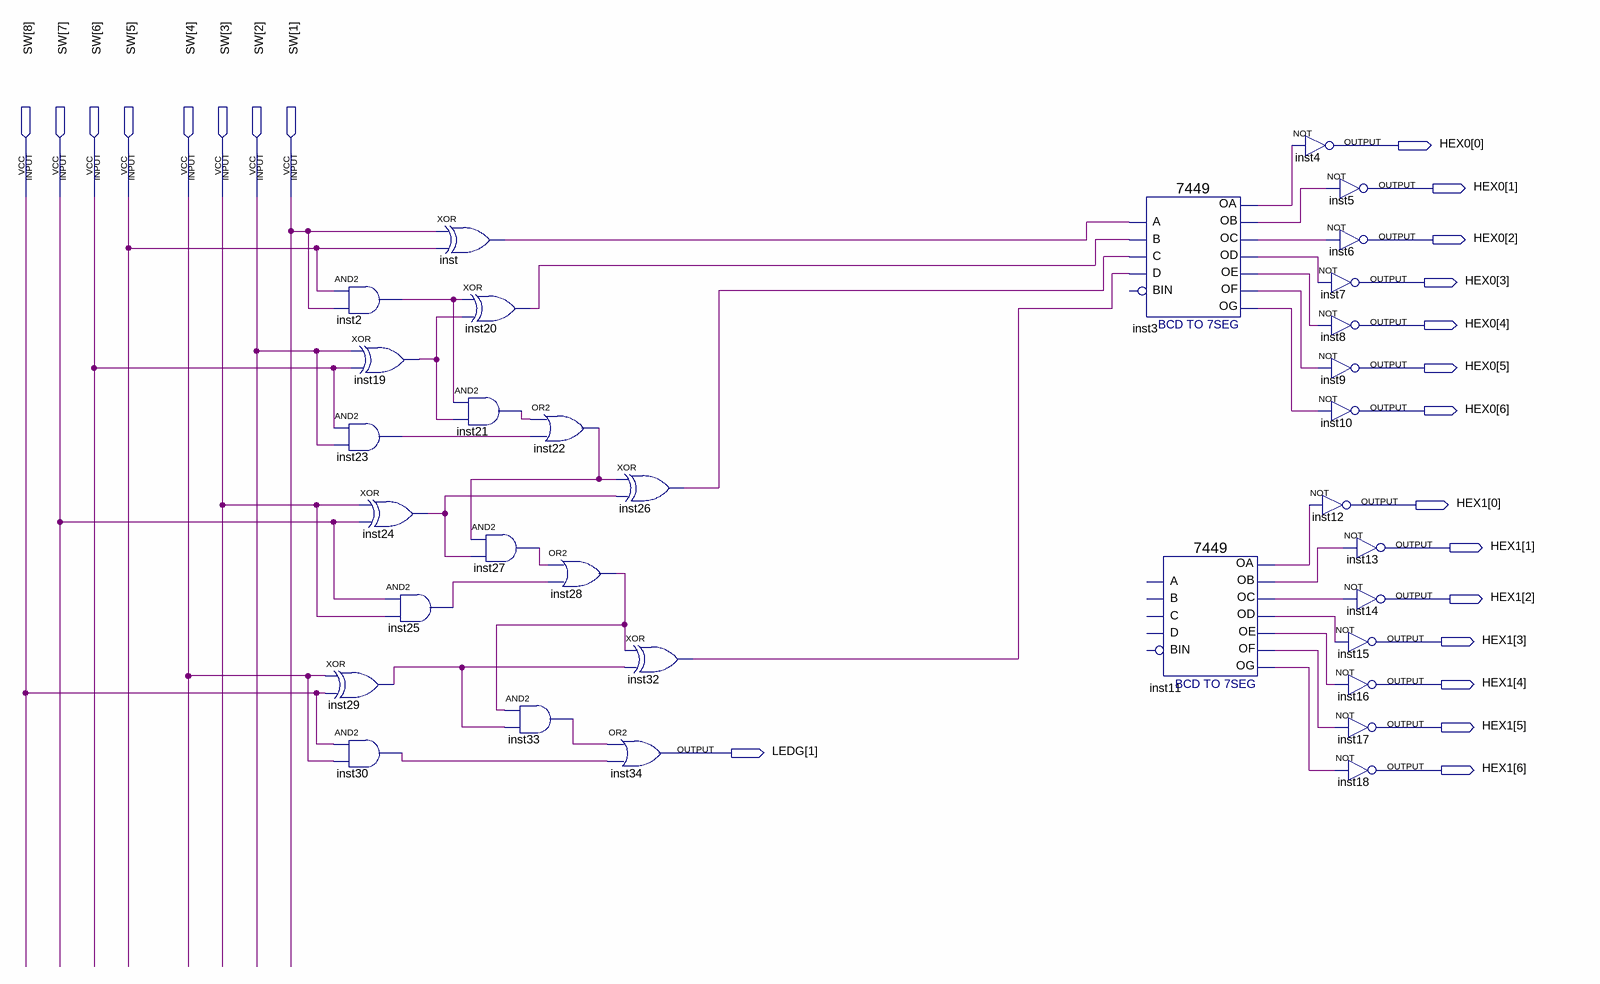
[diagram p0: schematic sheet]
// Quartus schematic MeioSomador4Bits.bdf as structural Verilog: 33 symbols, 23 pins
module MeioSomador4Bits (
  input  [8:1] SW,
  output [6:0] HEX0,
  output [6:0] HEX1,
  output [1:1] LEDG
);

  wire inst2_out, inst3_oa, inst3_ob, inst3_oc, inst3_od, inst3_oe, inst3_of, inst3_og, inst11_oa, inst11_ob,
       inst11_oc, inst11_od, inst11_oe, inst11_of, inst11_og, inst19_out, inst20_out, inst21_out, inst22_out,
       inst23_out, inst24_out, inst25_out, inst26_out, inst27_out, inst28_out, inst29_out, inst30_out,
       inst32_out, inst33_out, inst_out;

  and inst2 (inst2_out, SW[5], SW[1]);
  xor inst19 (inst19_out, SW[2], SW[6]);
  and inst23 (inst23_out, SW[6], SW[2]);
  xor inst24 (inst24_out, SW[3], SW[7]);
  xor inst29 (inst29_out, SW[4], SW[8]);
  and inst30 (inst30_out, SW[8], SW[4]);
  xor inst (inst_out, SW[1], SW[5]);
  and inst25 (inst25_out, SW[7], SW[3]);
  xor inst20 (inst20_out, inst2_out, inst19_out);
  and inst21 (inst21_out, inst2_out, inst19_out);
  and inst27 (inst27_out, inst22_out, inst24_out);
  and inst33 (inst33_out, inst28_out, inst29_out);
  or inst22 (inst22_out, inst21_out, inst23_out);
  or inst28 (inst28_out, inst27_out, inst25_out);
  xor inst26 (inst26_out, inst22_out, inst24_out);
  xor inst32 (inst32_out, inst28_out, inst29_out);
  or inst34 (LEDG[1], inst33_out, inst30_out);
  \7449  inst3 (
    .A(inst_out), .C(inst26_out), .B(inst20_out), .D(inst32_out), .OC(inst3_oc), .OD(inst3_od),
    .OF(inst3_of), .OG(inst3_og), .OB(inst3_ob), .OA(inst3_oa), .OE(inst3_oe));  // open: BIN
  \7449  inst11 (
    .OC(inst11_oc), .OD(inst11_od), .OF(inst11_of), .OG(inst11_og), .OB(inst11_ob), .OA(inst11_oa),
    .OE(inst11_oe));  // open: A, C, B, D, BIN
  not inst4 (HEX0[0], inst3_oa);
  not inst5 (HEX0[1], inst3_ob);
  not inst6 (HEX0[2], inst3_oc);
  not inst7 (HEX0[3], inst3_od);
  not inst8 (HEX0[4], inst3_oe);
  not inst9 (HEX0[5], inst3_of);
  not inst10 (HEX0[6], inst3_og);
  not inst12 (HEX1[0], inst11_oa);
  not inst15 (HEX1[3], inst11_od);
  not inst16 (HEX1[4], inst11_oe);
  not inst17 (HEX1[5], inst11_of);
  not inst18 (HEX1[6], inst11_og);
  not inst13 (HEX1[1], inst11_ob);
  not inst14 (HEX1[2], inst11_oc);
endmodule
